# Altium schematic sheet BBB-Supply.SchDoc: BBB Supply
size OrCAD A; DocumentNumber: LM-008; Revision: C; SheetNumber: 5; SheetTotal: 6
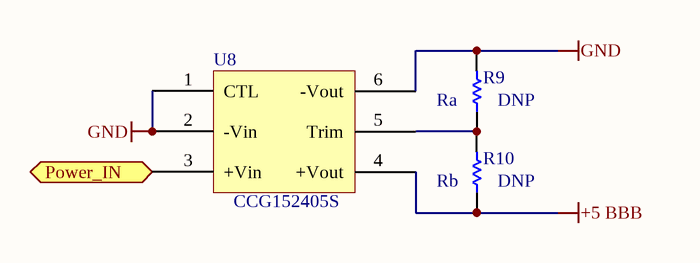
[diagram p0: BBB-Supply.SchDoc]

## Parts
R9  DNP  [RESC0805(2012)_M]
R10  DNP  [RESC0805(2012)_M]
U8  CCG152405S  [PXB15-24WS05/NT]

## Ports
Power_IN

## Nets
+5 BBB: R10.1 U8.4(+Vout)
GND: R9.2 U8.1(CTL) U8.2(-Vin) U8.6(-Vout)
Power_IN: U8.3(+Vin) ; port Power_IN
NetR9_1: R9.1 R10.2 U8.5(Trim)

## Notes on the sheet
- (near R9) Ra
- (near R10) Rb
- Title
- Size:
- Date:
- Orcad A
- Number:
- Time:
- Revision:
- Sheet
- of
- ZLS Corporation
- 7801 North Lamar Blvd.
- Suite E-184
- Austin, Texas 78752  USA
- (512) 453-0288
- File:

## Library data of the parts
R9 = CMP-1013-00017-1: Vout = 12.05 ­ (445.7 / 63.1+Ra)
R10 = CMP-1013-00017-1: Vout = 12.05 + (50.96 / 22+Rb)
U8 = PXB15-24WS05/NT: DC DC CONVERTER 5V 15W; Manufacturer: TDK-Lambda Americas Inc.; Voltage - Input (Min): 9V; Voltage - Input (Max): 36V; Current - Output (Max): 3A; Efficiency: 87%; Control Features: Enable, Active Low; Supplier 1: Digi-Key; Supplier Part Number 1: 285-2605-ND; Manufacturer Part Number: CCG152405S; RoHS: RoHS Compliant; Category: Power Supplies - Board Mount; Stock 1: 154; Pricing 1: 1=28.5, 10=27.75 (USD); Packaging: Tube; Part Status: Active; Type: Isolated Module; Voltage - Output 1: 5V; Voltage - Output 2: -; Voltage - Output 3: -; Applications: ITE (Commercial); Features: Remote On/Off, OCP, OVP; Operating Temperature: -40°C ~ 85°C; Mounting Type: Through Hole; Package / Case: 6-DIP Module; Size / Dimension: 1.00" L x 1.00" W x 0.39" H (25.4mm x 25.4mm x 9.9mm); ComponentLink1URL: http://www.us.tdk-lambda.com/ftp/specs/ccg15.pdf; ComponentLink1Description: http://www.us.tdk-lambda.com/ftp/specs/ccg15.pdf